# EAGLE design mini-usb-breakout (EAGLE 6.4)
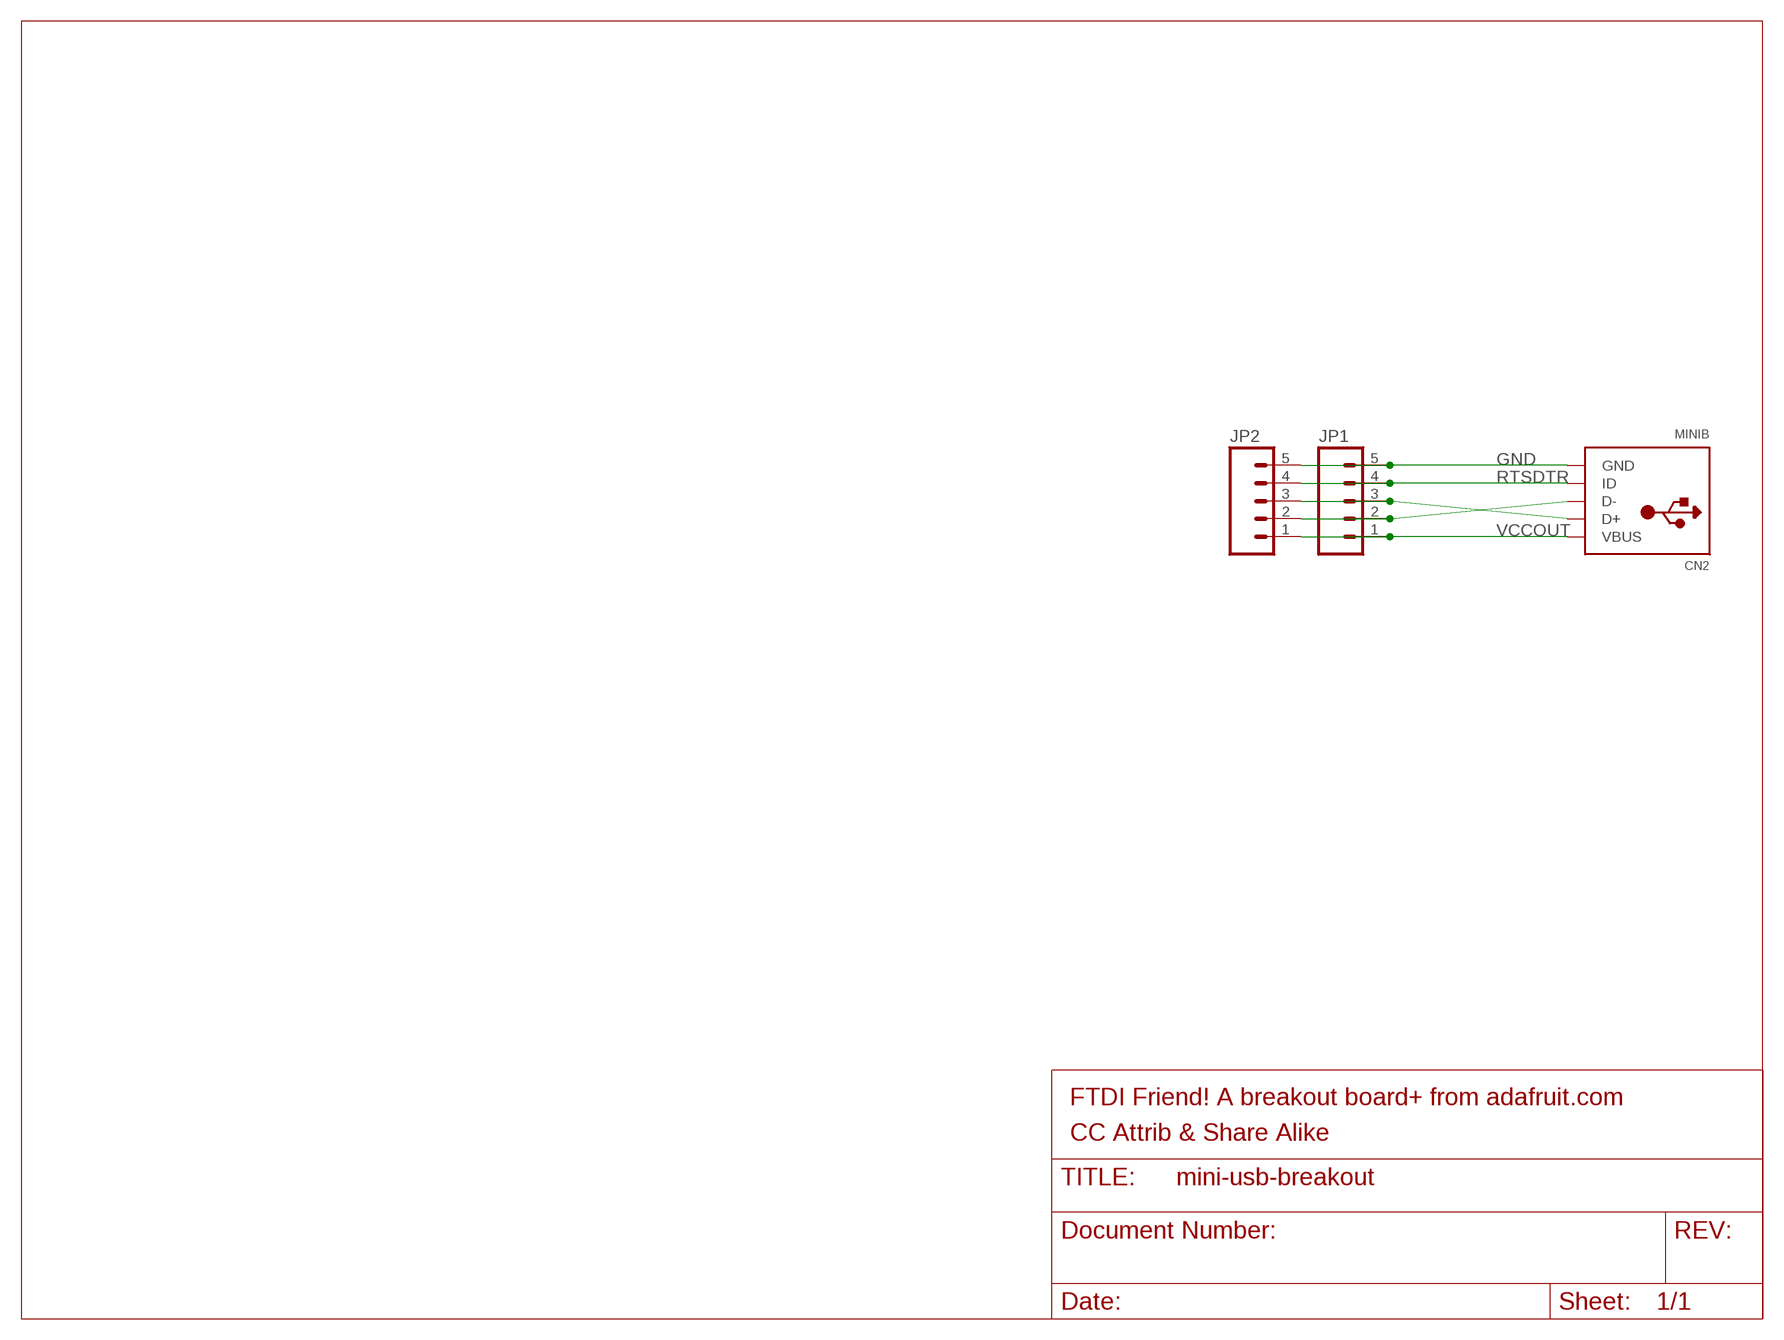
[diagram p0: schematic, sheet 1]

## Parts
CN2  MINIB  USBMINIB  [USB-MINIB]
JP1  M05PTH  [1X05]
JP2  M05PTH  [1X05]

## Nets
GND: CN2.GND JP1.5 JP2.5
N$2: CN2.D+ JP1.3 JP2.3
N$3: CN2.D- JP1.2 JP2.2
RTSDTR: CN2.ID JP1.4 JP2.4
VCCOUT: CN2.VBUS JP1.1 JP2.1

## Notes on the sheet
- FTDI Friend! A breakout board+ from adafruit.com
- CC Attrib & Share Alike

## Library data of the parts
CN2 = adafruit:USB: USB Connectors USBMINIB - Surface Mount Female Mini-B USB Connector 4UConnector: 06564 By microbuilder.eu Thru-hole RA Female Mini-B USB Connector 4UConnector: 18732 By ladyada.net
JP1 JP2 = SparkFun-Connectors:M05: Header 5 Standard 5-pin 0.1" header. Use with straight break away headers (SKU : PRT-00116), right angle break away headers (PRT-00553), swiss pins (PRT-00743), machine pins (PRT-00117), and female headers (PRT-00115). Molex polarized connector foot print use with SKU : PRT-08230 with associated crimp pins and housings.

## Board
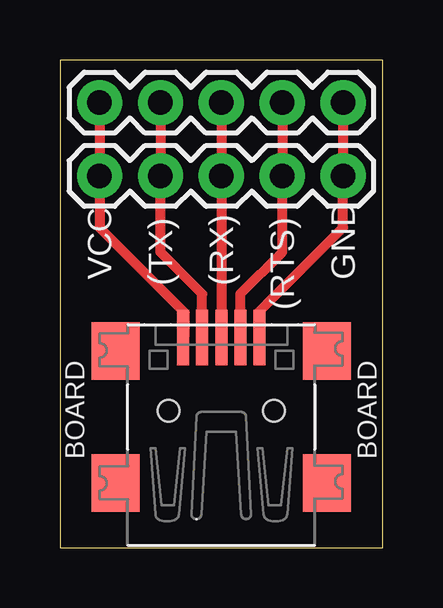
[diagram p1: board, top side]
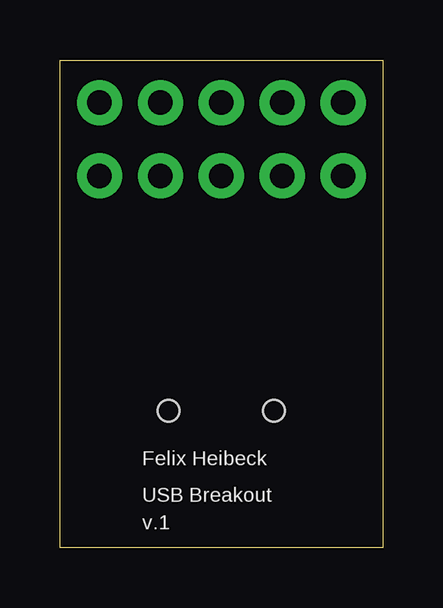
[diagram p2: board, bottom side, seen from below]

Size 13.46 x 20.32 mm. Coordinates in mm from the lower left corner, seen from the top.
Outline: 0,20.32 0,0 13.46,0 13.46,20.32 0,20.32
Copper layers (1*16): Top 0.035mm / dielectric 1.5mm / Bottom 0.035mm
Design rules "default *": minimum track width 10mil, minimum drill 19mil, track to track 8mil, track to pad 8mil, pad to pad 8mil, via to via 8mil, smd to smd 8mil, copper to edge 20mil, drill to drill 8mil, minimum pad ring 10mil, minimum via ring 8mil, stop-mask expansion 4mil, vias tented up to drill 20mil, thermal gap 10mil

### Footprints (pad centres in the part's own frame; a part is rotated, then mirrored left to right if it is on the bottom)
USB-MINIB = smd 0.5 x 2.308: D+ 0,4.064; D- -0.8,4.064; GND 1.6,4.064; ID 0.8,4.064; VBUS -1.6,4.064 | smd 2 x 2.4: GND1 -4.4,-2; GND2 -4.4,3.5; GND3 4.4,3.5; GND4 4.4,-2 | hole 0.9: -2.2,1; 2.2,1
1X05 = drill 1.016 pad 1.88: 1 0,0; 2 2.54,0; 3 5.08,0; 4 7.62,0; 5 10.16,0

### Placement (x,y rotation side)
CN2  6.73,4.7 0 top
JP1  1.65,15.49 0 top
JP2  1.65,18.54 0 top

### Tracks (layer width: path | path; a pad name or v marks a point on that pad's centre or on a via)
GND
  Top 0.406: CN2.GND 8.33,9.86 11.81,13.34 JP1.5 JP2.5
N$2
  Top 0.406: CN2.D+ JP1.3 JP2.3
N$3
  Top 0.406: CN2.D- 5.93,10.58 4.19,12.32 JP1.2 JP2.2
RTSDTR
  Top 0.406: CN2.ID 7.53,10.58 9.27,12.32 JP1.4 JP2.4
VCCOUT
  Top 0.406: CN2.VBUS 5.21,8.84 5.21,9.78 1.65,13.34 JP1.1 JP2.1

### Text on the board
tPlace: VCC | (TX) | (RX) | GND | (RTS) | BOARD | BOARD
bPlace: Felix Heibeck | USB Breakout | v.1